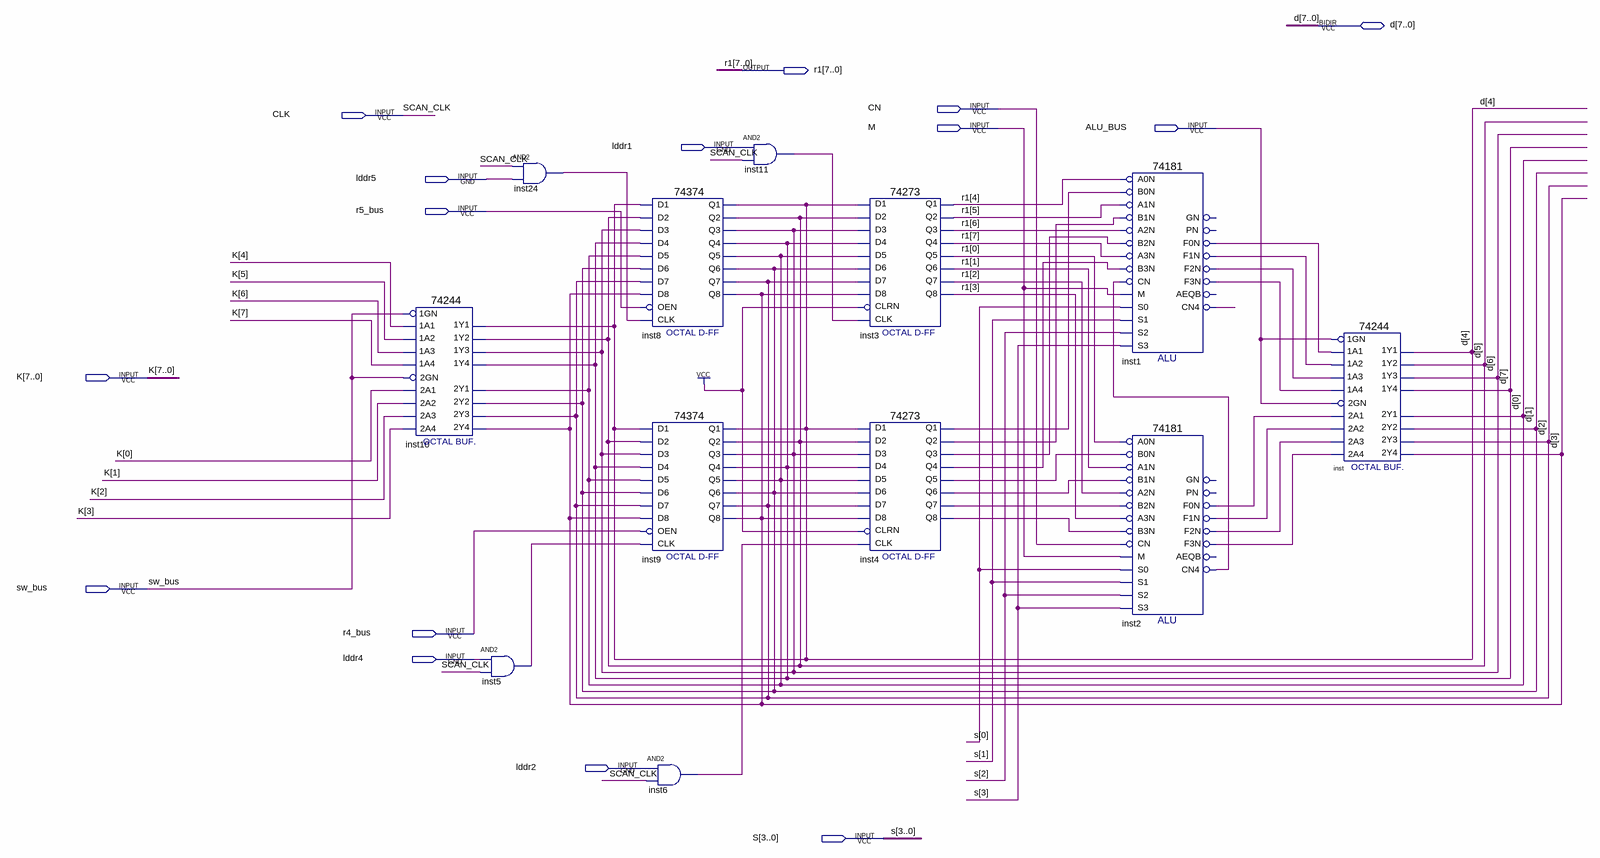
[diagram p0: schematic sheet]
// Quartus schematic exp_r_alu.bdf as structural Verilog: 12 symbols, 15 pins
module exp_r_alu (
  input  CN,
  input  CLK,
  input  M,
  input  ALU_BUS,
  input  lddr1,
  input  lddr5,
  input  r5_bus,
  input  [7:0] K,
  input  sw_bus,
  input  r4_bus,
  input  lddr4,
  input  lddr2,
  input  [3:0] S,
  inout  [7:0] d,
  output [7:0] r1
);

  wire inst1_cn4, inst1_f0n, inst1_f1n, inst1_f2n, inst1_f3n, inst2_cn4, inst2_f0n, inst2_f1n, inst2_f2n,
       inst2_f3n, inst4_q1, inst4_q2, inst4_q3, inst4_q4, inst4_q5, inst4_q6, inst4_q7, inst4_q8, inst5_out,
       inst6_out, inst11_out, inst24_out;

  \74244  inst10 (
    .\1A2 (K[5]), .\1A4 (K[7]), .\1A1 (K[4]), .\1A3 (K[6]), .\1GN (sw_bus), .\2A3 (K[2]), .\2GN (sw_bus),
    .\2A1 (K[0]), .\2A4 (K[3]), .\2A2 (K[1]), .\1Y2 (d[5]), .\1Y4 (d[7]), .\2Y1 (d[0]), .\1Y1 (d[4]),
    .\2Y3 (d[2]), .\2Y4 (d[3]), .\1Y3 (d[6]), .\2Y2 (d[1]));
  and inst5 (inst5_out, lddr4, CLK);
  and inst24 (inst24_out, CLK, lddr5);
  \74374  inst8 (
    .D1(d[4]), .D2(d[5]), .D3(d[6]), .D4(d[7]), .D6(d[1]), .D5(d[0]), .OEN(r5_bus), .D8(d[3]), .D7(d[2]),
    .CLK(inst24_out), .Q2(d[5]), .Q3(d[6]), .Q5(d[0]), .Q4(d[7]), .Q6(d[1]), .Q7(d[2]), .Q8(d[3]), .Q1(d[4]));
  \74374  inst9 (
    .D1(d[4]), .D2(d[5]), .D3(d[6]), .D4(d[7]), .D6(d[1]), .D5(d[0]), .OEN(r4_bus), .D8(d[3]), .D7(d[2]),
    .CLK(inst5_out), .Q2(d[5]), .Q3(d[6]), .Q5(d[0]), .Q4(d[7]), .Q6(d[1]), .Q7(d[2]), .Q8(d[3]), .Q1(d[4]));
  and inst6 (inst6_out, lddr2, CLK);
  and inst11 (inst11_out, lddr1, CLK);
  \74273  inst3 (
    .D2(d[5]), .D3(d[6]), .D1(d[4]), .D4(d[7]), .D7(d[2]), .D6(d[1]), .D5(d[0]), .D8(d[3]), .CLK(inst11_out),
    .CLRN(1'b1), .Q4(r1[7]), .Q1(r1[4]), .Q2(r1[5]), .Q3(r1[6]), .Q6(r1[1]), .Q5(r1[0]), .Q7(r1[2]),
    .Q8(r1[3]));
  \74273  inst4 (
    .D2(d[5]), .D3(d[6]), .D1(d[4]), .D4(d[7]), .D7(d[2]), .D6(d[1]), .D5(d[0]), .D8(d[3]), .CLK(inst6_out),
    .CLRN(1'b1), .Q4(inst4_q4), .Q1(inst4_q1), .Q2(inst4_q2), .Q3(inst4_q3), .Q6(inst4_q6), .Q5(inst4_q5),
    .Q7(inst4_q7), .Q8(inst4_q8));
  \74181  inst1 (
    .B0N(inst4_q1), .A0N(r1[4]), .A1N(r1[5]), .B1N(inst4_q2), .A3N(r1[7]), .B2N(inst4_q3), .A2N(r1[6]),
    .M(M), .CN(inst2_cn4), .B3N(inst4_q4), .S2(S[2]), .S1(S[1]), .S0(S[0]), .S3(S[3]), .F3N(inst1_f3n),
    .F1N(inst1_f1n), .F0N(inst1_f0n), .CN4(inst1_cn4), .F2N(inst1_f2n));  // open: PN, GN, AEQB
  \74181  inst2 (
    .B0N(inst4_q5), .A0N(r1[0]), .A1N(r1[1]), .B1N(inst4_q6), .A3N(r1[3]), .B2N(inst4_q7), .A2N(r1[2]),
    .M(M), .CN(CN), .B3N(inst4_q8), .S2(S[2]), .S1(S[1]), .S0(S[0]), .S3(S[3]), .F3N(inst2_f3n),
    .F1N(inst2_f1n), .F0N(inst2_f0n), .CN4(inst2_cn4), .F2N(inst2_f2n));  // open: PN, GN, AEQB
  \74244  inst (
    .\1A2 (inst1_f1n), .\1A4 (inst1_f3n), .\1A1 (inst1_f0n), .\1A3 (inst1_f2n), .\1GN (ALU_BUS),
    .\2A3 (inst2_f2n), .\2GN (ALU_BUS), .\2A1 (inst2_f0n), .\2A4 (inst2_f3n), .\2A2 (inst2_f1n),
    .\1Y2 (d[5]), .\1Y4 (d[7]), .\2Y1 (d[0]), .\1Y1 (d[4]), .\2Y3 (d[2]), .\2Y4 (d[3]), .\1Y3 (d[6]),
    .\2Y2 (d[1]));

  // Other names for the same wires on the sheet: SCAN_CLK = CLK
endmodule
